# Altium schematic sheet Communication.SchDoc
size A4
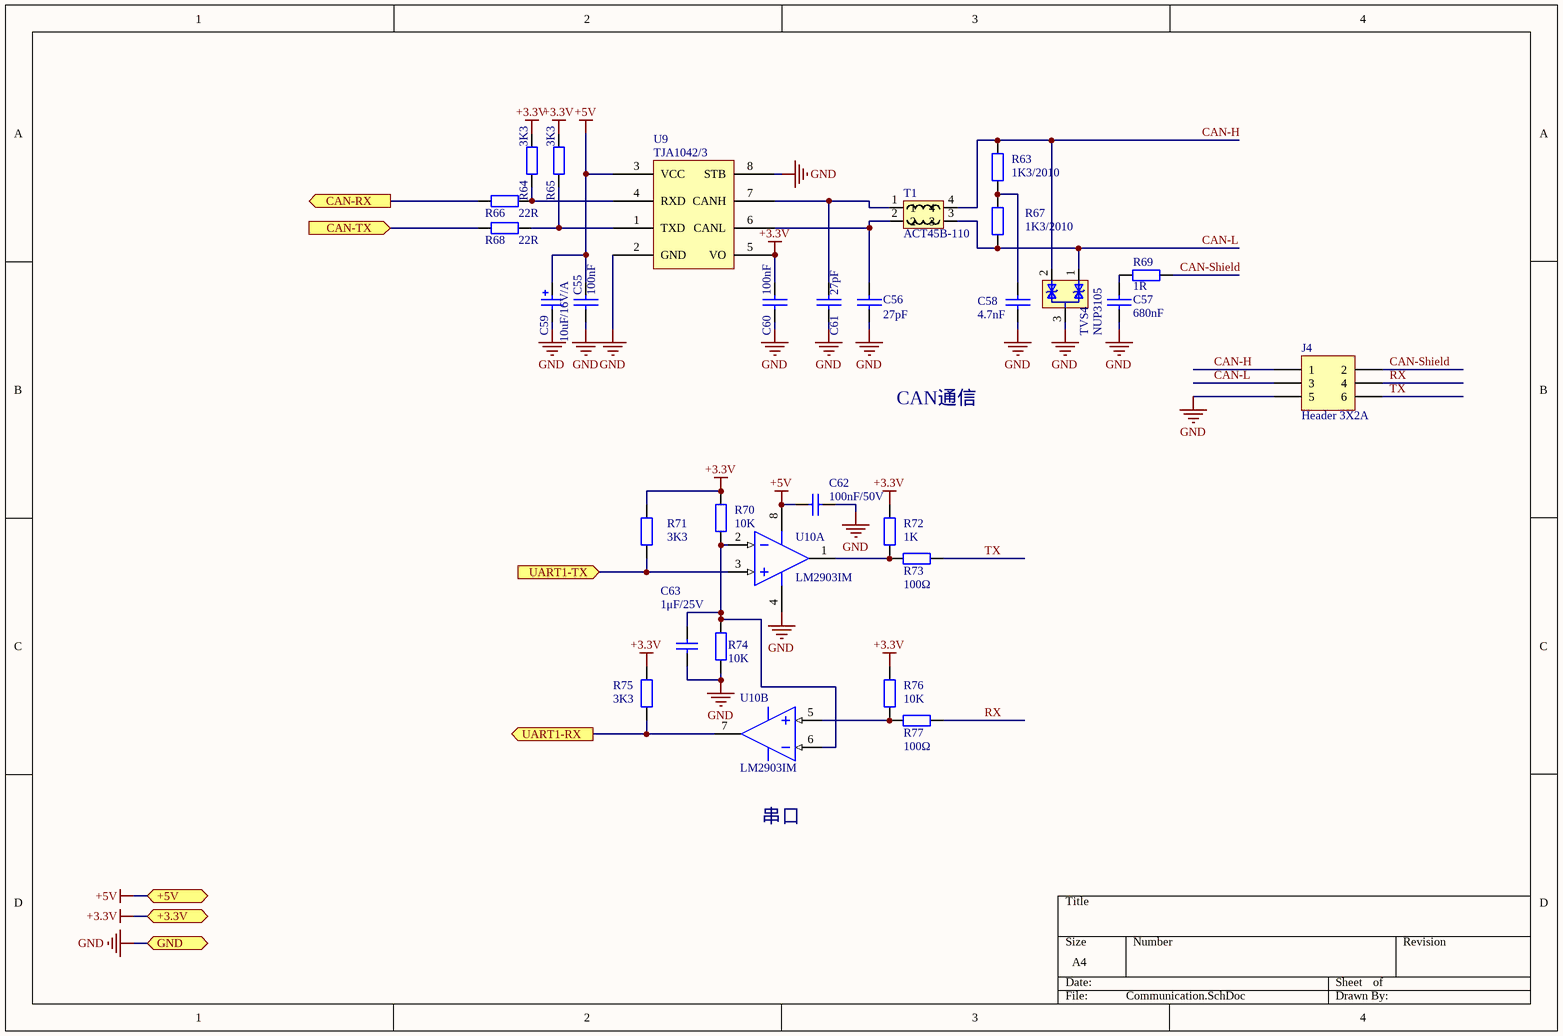
[diagram p0: Communication.SchDoc]

## Parts
C55  100nF  [0603]
C56  27pF  [0603]
C57  680nF  [0805]
C58  4.7nF  [0603]
C59  10uF/16V/A  [SMD3216-A]
C60  100nF  [0603]
C61  27pF  [0603]
C62  100nF/50V  [0603]
C63  1μF/25V  [0603]
J4  Header 3X2A  [2.54-6pin-针]
R63  1K3/2010  [2010]
R64  3K3  [0603]
R65  3K3  [0603]
R66  22R  [0603]
R67  1K3/2010  [2010]
R68  22R  [0603]
R69  1R  [0805]
R70  10K  [0603]
R71  3K3  [0603]
R72  1K  [0603]
R73  100Ω  [0805]
R74  10K  [0603]
R75  3K3  [0603]
R76  10K  [0603]
R77  100Ω  [0805]
T1  ACT45B-110  [ACT45B]
TVS4  NUP3105  [SOT-23]
U9  TJA1042/3  [SOP-8]
U10  LM2903IM  [SOP-8]  (parts A,B of 2)

## Ports
+3.3V, +5V, CAN-RX (out), CAN-TX (in), GND, UART1-RX (out), UART1-TX (in)

## Nets
+3.3V: C60.1 R64.2 R65.2 R70.2 R71.2 R72.2 R75.2 R76.2 U9.5(VO) ; port +3.3V
+5V: C55.1 C59.1 C62.2 U9.3(VCC) U10.8(V+) ; port +5V
GND: C55.2 C56.1 C57.2 C58.1 C59.2 C60.2 C61.1 C62.1 C63.1 J4.5 R74.1 TVS4.3 U9.2(GND) U9.8(STB) U10.4(V-) ; port GND
CAN-H: J4.1 R63.1 T1.4 TVS4.2
CAN-L: J4.3 R67.1 T1.3 TVS4.1
CAN-RX: R66.2 ; port CAN-RX
CAN-Shield: J4.2 R69.2
CAN-TX: R68.2 ; port CAN-TX
RX: J4.4 R77.1
TX: J4.6 R73.1
UART1-RX: R75.1 U10.7(OUT) ; port UART1-RX
UART1-TX: R71.1 U10.3(IN+) ; port UART1-TX
NetC56_2: C56.2 T1.2 U9.6(CANL)
NetC57_1: C57.1 R69.1
NetC58_2: C58.2 R63.2 R67.2
NetC61_2: C61.2 T1.1 U9.7(CANH)
NetC63_2: C63.2 R70.1 R74.2 U10.2(IN-) U10.6(IN-)
NetR64_1: R64.1 R66.1 U9.4(RXD)
NetR65_1: R65.1 R68.1 U9.1(TXD)
NetR72_1: R72.1 R73.2 U10.1(OUT)
NetR76_1: R76.1 R77.2 U10.5(IN+)

## Notes on the sheet
- CAN通信
- 串口

## Library data of the parts
C55-C58 C60 C61 = CAP: Capacitor
C59 = Cap Pol
C62 C63 = Cap: Capacitor; Published: 8-Jun-2000; LatestRevisionDate: 17-Jul-2002; LatestRevisionNote: Re-released for DXP Platform.; PackageReference: RAD-0.3; Publisher: Altium Limited
J4 = Header 3X2A: 5569-06,弯角
R63-R71 R73-R77 = Res2: Resistor; Value: 1K; Published: 8-Jun-2000; LatestRevisionDate: 17-Jul-2002; LatestRevisionNote: Re-released for DXP Platform.; PackageReference: AXIAL-0.4; Publisher: Altium Limited
R72 = Res2: Resistor; Published: 8-Jun-2000; LatestRevisionDate: 17-Jul-2002; LatestRevisionNote: Re-released for DXP Platform.; PackageReference: AXIAL-0.4; Publisher: Altium Limited; Value: 1K
T1 = ZJYS81R5-2PL51-G01: 晶体共模滤波器
TVS4 = NUP2105
U9 = TJA1040T
U10 = LM293AD: Low-Power Dual Voltage Comparator; Published: 24-Aug-2001; LatestRevisionDate: 13-Apr-2006; LatestRevisionNote: IPC-7351 Footprint Added.; DatasheetVersion: Nov-1992; PackageVersion: Dec-2002; PackageReference: SO8; Publisher: Altium Limited; PackageDescription: 8-Pin Small Outline Integrated Circuit 1.27 mm Pitch; Code_JEDEC: MS-012-AA; Code_IPC: SOIC127P600-8; ComponentLink1Description: Manufacturer Link; ComponentLink1URL: http://www.st.com/; ComponentLink2Description: Datasheet; ComponentLink2URL: http://www.st.com/stonline/products/literature/ds/2164/lm193.pdf